# EAGLE design sha2017_rev0_0_1_dev (EAGLE 6.6.0)
Assembly variants: PRODUCTION

## Sheet 1 of 3
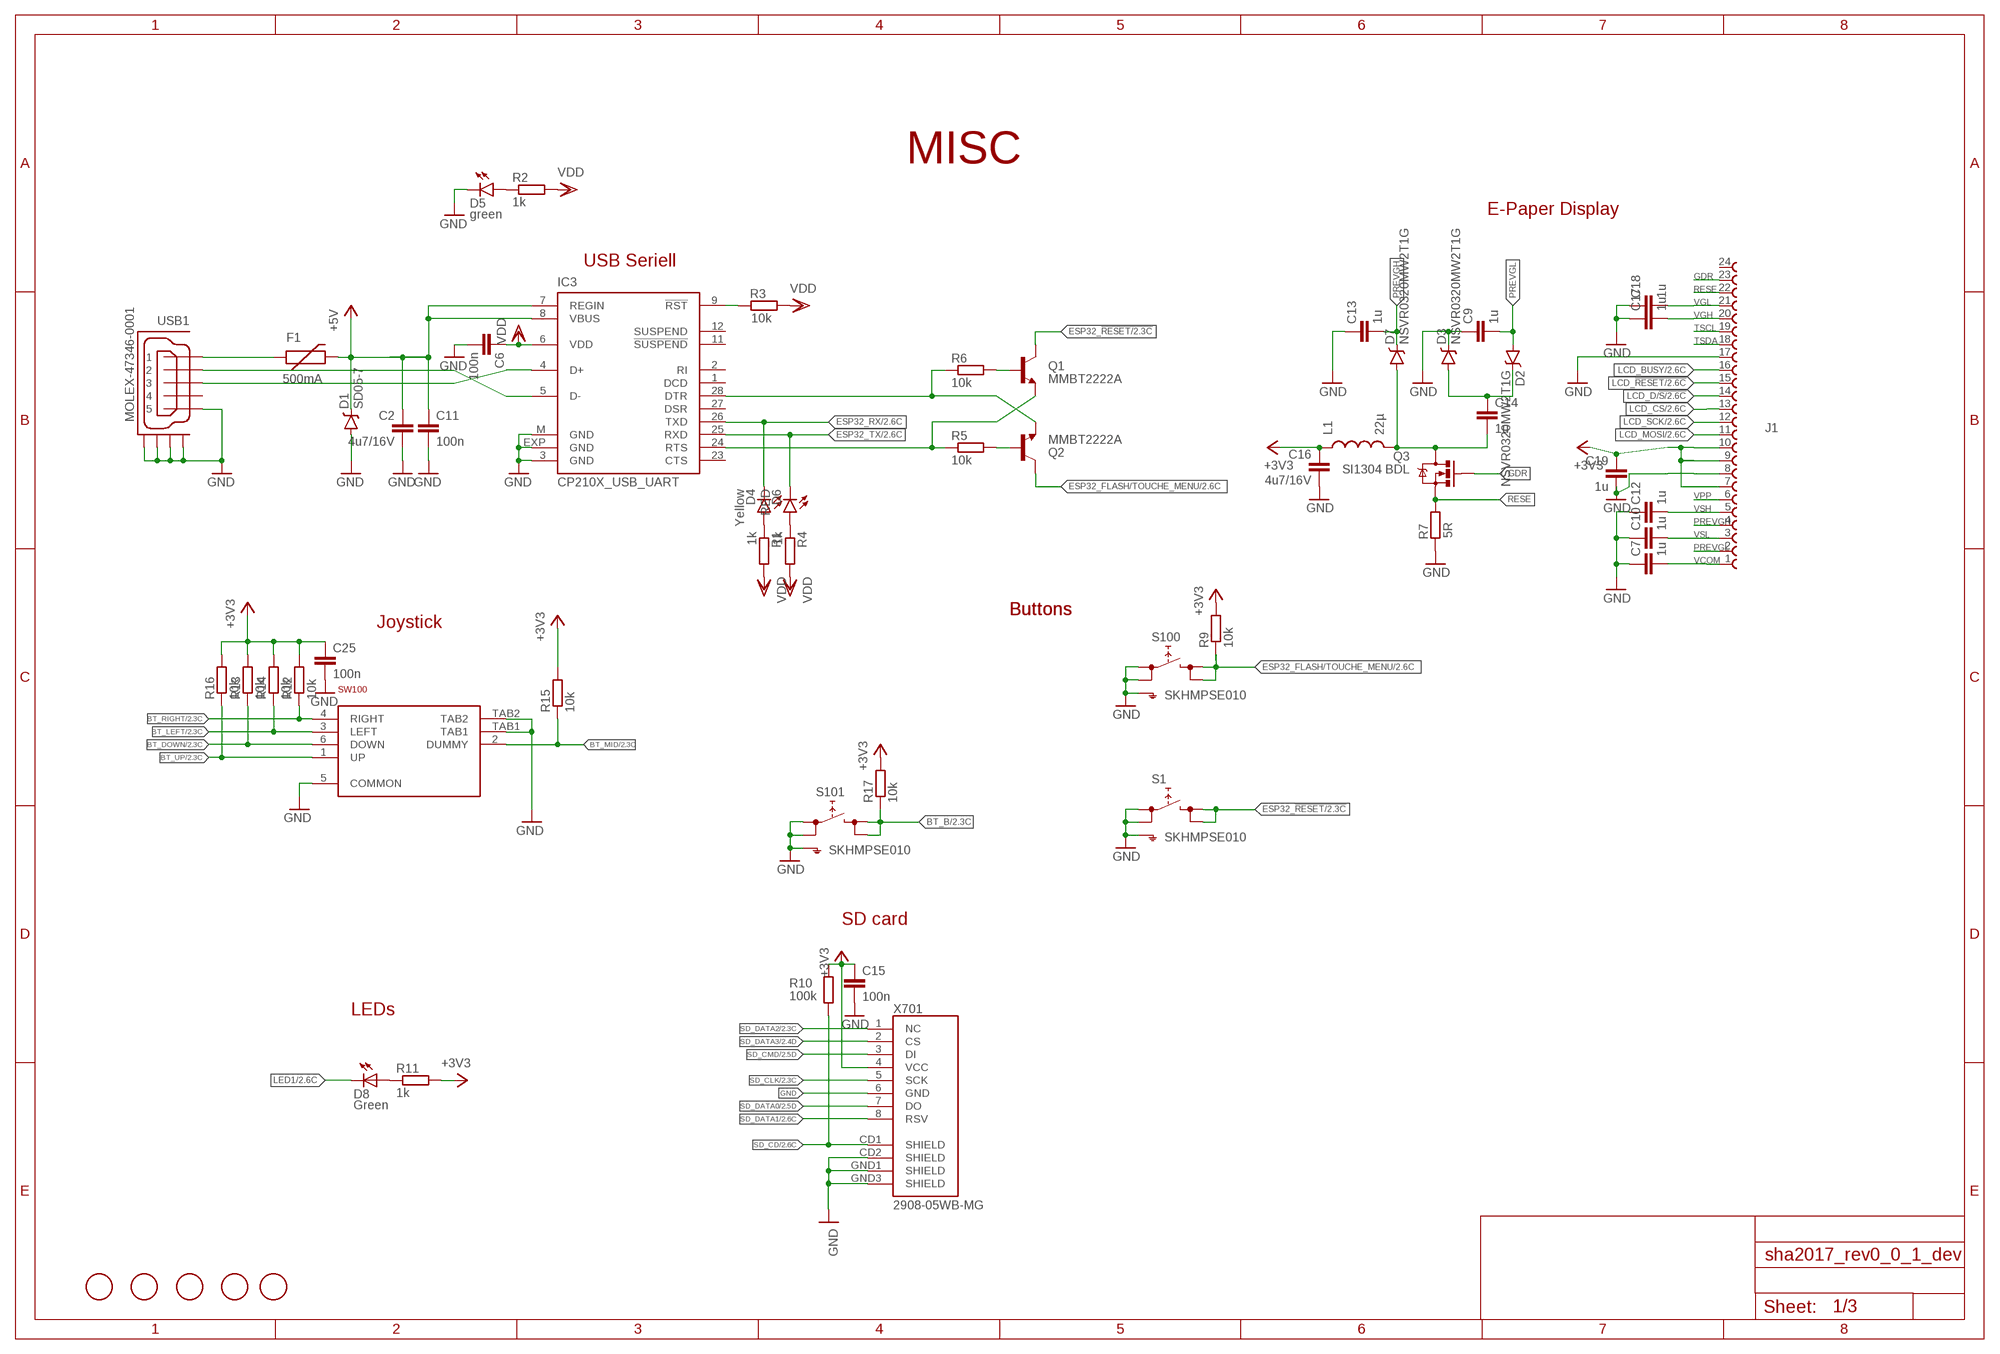
[diagram p0: schematic, sheet 1]

### Parts
C2  4u7/16V  C-EUC0805  [C0805]
C6  100n  C-EUC0603  [C0603]
C7  1u  C-EUC0603  [C0603]
C9  1u  C-EUC0603  [C0603]
C10  1u  C-EUC0603  [C0603]
C11  100n  C-EUC0603  [C0603]
C12  1u  C-EUC0603  [C0603]
C13  1u  C-EUC0603  [C0603]
C14  1u  C-EUC0603  [C0603]
C15  100n  C-EUC0603  [C0603]
C16  4u7/16V  C-EUC0805  [C0805]
C17  1u  C-EUC0603  [C0603]
C18  1u  C-EUC0603  [C0603]
C19  1u  C-EUC0603  [C0603]
C25  100n  C-EUC0603  [C0603]
D1  SD05-7  DIODE-SCHOTTKY-PMEG4005EJ  [SOD-323]
D2  NSVR0320MW2T1G  BAT20JFILM  [SOD-323]
D3  NSVR0320MW2T1G  BAT20JFILM  [SOD-323]
D4  Yellow  LED0603  [LED-0603]
D5  green  LED0603  [LED-0603]
D6  RED  LED0603  [LED-0603]
D7  NSVR0320MW2T1G  BAT20JFILM  [SOD-323]
D8  Green  LEDSML1206  [SML1206]
F1  500mA  PTCSMD  [PTC-1206]
FD1  FIDUCIAL  [FIDUCIAL_1MM]
FD2  FIDUCIAL  [FIDUCIAL_1MM]
FD3  FIDUCIAL  [FIDUCIAL_1MM]
FD4  FIDUCIAL  [FIDUCIAL_1MM]
FD5  FIDUCIAL  [FIDUCIAL_1MM]
IC3  CP210X_USB_UART  [MLP28]
J1  68712414022  [68712414022]
L1  22µ  INDUCTOR1210  [1210]
Q1  MMBT2222A  TRANSISTOR_NPNMMBT2222A  [SOT23-3]
Q2  MMBT2222A  TRANSISTOR_NPNMMBT2222A  [SOT23-3]
Q3  SI1304 BDL  MOSFET-NCHANNEL2N7002PW  [SOT323]
R1  1k  R-EU_R0603  [R0603]
R2  1k  R-EU_R0603  [R0603]
R3  10k  R-EU_R0603  [R0603]
R4  1k  R-EU_R0603  [R0603]
R5  10k  R-EU_R0603  [R0603]
R6  10k  R-EU_R0603  [R0603]
R7  5R  R0603-DASHES  [R0603-DASHES]
R9  10k  R-EU_R0603  [R0603]
R10  100k  R-EU_R0603  [R0603]
R11  1k  R-EU_R0603  [R0603]
R12  10k  R-EU_R0603  [R0603]
R13  10k  R-EU_R0603  [R0603]
R14  10k  R-EU_R0603  [R0603]
R15  10k  R-EU_R0603  [R0603]
R16  10k  R-EU_R0603  [R0603]
R17  10k  R-EU_R0603  [R0603]
S1  SKHMPSE010  [SKHMPXE010]
S100  SKHMPSE010  [SKHMPXE010]
S101  SKHMPSE010  [SKHMPXE010]
SW100  MCMT5-F-V  [MCMT5-F-V]
USB1  MOLEX-47346-0001  [MOLEX-47364-0001]
X701  2908-05WB-MG  [MICRO-SD-SOCKET-PP]  (not fitted in variant PRODUCTION)

### Nets
+3V3: C15.1 C16.1 C19.1 C25.1 J1.7 J1.9 J1.10 L1.1 R9.2 R10.1 R11.2 R12.2 R13.2 R14.2 R15.2 R16.2 R17.2 X701.4(VCC) ; also sheet 2,3
+5V [GND/3V3]: C2.1 C11.1 D1.C F1.2 IC3.7(REGIN) IC3.8(VBUS) ; also sheet 3
BT_B: R17.1 S101.3(2.1) S101.4(2.2) ; also sheet 2
BT_DOWN: R13.1 SW100.6(DOWN) ; also sheet 2
BT_LEFT: R14.1 SW100.3(LEFT) ; also sheet 2
BT_MID: R15.1 SW100.2(DUMMY) ; also sheet 2
BT_RIGHT: R12.1 SW100.4(RIGHT) ; also sheet 2
BT_UP: R16.1 SW100.1(UP) ; also sheet 2
ESP32_!RESET: Q1.3(C) S1.3(2.1) S1.4(2.2) ; also sheet 2
ESP32_FLASH/TOUCHE_MENU: Q2.3(C) R9.1 S100.3(2.1) S100.4(2.2) ; also sheet 2
ESP32_RX: D4.C IC3.26(TXD) ; also sheet 2
ESP32_TX: D6.C IC3.25(RXD) ; also sheet 2
GDR: J1.23 Q3.1(G)
GND: C2.2 C6.2 C7.1 C9.1 C10.1 C11.2 C12.1 C13.1 C15.2 C16.2 C17.1 C18.1 C19.2 C25.2 D1.A D3.C D5.C IC3.3(GND) IC3.EXP(GND) IC3.M(GND) J1.8 J1.17 R7.2 S1.1(1.1) S1.2(1.2) S1.5(SH) S100.1(1.1) S100.2(1.2) S100.5(SH) S101.1(1.1) S101.2(1.2) S101.5(SH) SW100.5(COMMON) SW100.TAB1 SW100.TAB2 USB1.5 USB1.GND1 USB1.GND2 USB1.GND3 USB1.GND4 X701.6(GND) X701.CD2(SHIELD) X701.GND1(SHIELD) X701.GND3(SHIELD) ; also sheet 2,3
LCD_!RESET: J1.15 ; also sheet 2
LCD_BUSY: J1.16 ; also sheet 2
LCD_CS: J1.13 ; also sheet 2
LCD_D/!S: J1.14 ; also sheet 2
LCD_MOSI: J1.11 ; also sheet 2
LCD_SCK: J1.12 ; also sheet 2
LED1: D8.C ; also sheet 2
N$8: IC3.9(!RST) R3.2
N$10: IC3.24(RTS) Q1.2(E) R5.1
N$11: IC3.28(DTR) Q2.2(E) R6.1
N$13: Q2.1(B) R5.2
N$14: Q1.1(B) R6.2
N$22: C14.1 D2.C D3.A
N$23: C14.2 D7.A L1.2 Q3.3(D)
N$25: D8.A R11.1
N$26: D5.A R2.1
N$27: D4.A R1.1
N$28: D6.A R4.1
N$32 [GND/3V3]: F1.1 USB1.1
PREVGH: C13.2 D7.C J1.4
PREVGL: C9.2 D2.A J1.2
RESE: J1.22 Q3.2(S) R7.1
SD_CD: R10.2 X701.CD1(SHIELD) ; also sheet 2
SD_CLK: X701.5(SCK) ; also sheet 2
SD_CMD: X701.3(DI) ; also sheet 2
SD_DATA0: X701.7(DO) ; also sheet 2
SD_DATA1: X701.8(RSV) ; also sheet 2
SD_DATA2: X701.1(NC) ; also sheet 2
SD_DATA3: X701.2(CS) ; also sheet 2
TSCL: J1.19
TSDA: J1.18
USB_DN_CON: IC3.5(D-) USB1.2
USB_DP_CON: IC3.4(D+) USB1.3
VCOM: C7.2 J1.1
VDD: C6.1 IC3.6(VDD) R1.2 R2.2 R3.1 R4.2
VGH: C17.2 J1.20
VGL: C18.2 J1.21
VPP: J1.6
VSH: C12.2 J1.5
VSL: C10.2 J1.3
Unconnected: IC3.1(DCD) IC3.2(RI) IC3.11(!SUSPEND) IC3.12(SUSPEND) IC3.23(CTS) IC3.27(DSR) J1.24 USB1.4

### Notes on the sheet
- MISC
- E-Paper Display
- USB Seriell
- Buttons | Buttons
- Joystick
- SD card
- LEDs

## Sheet 2 of 3
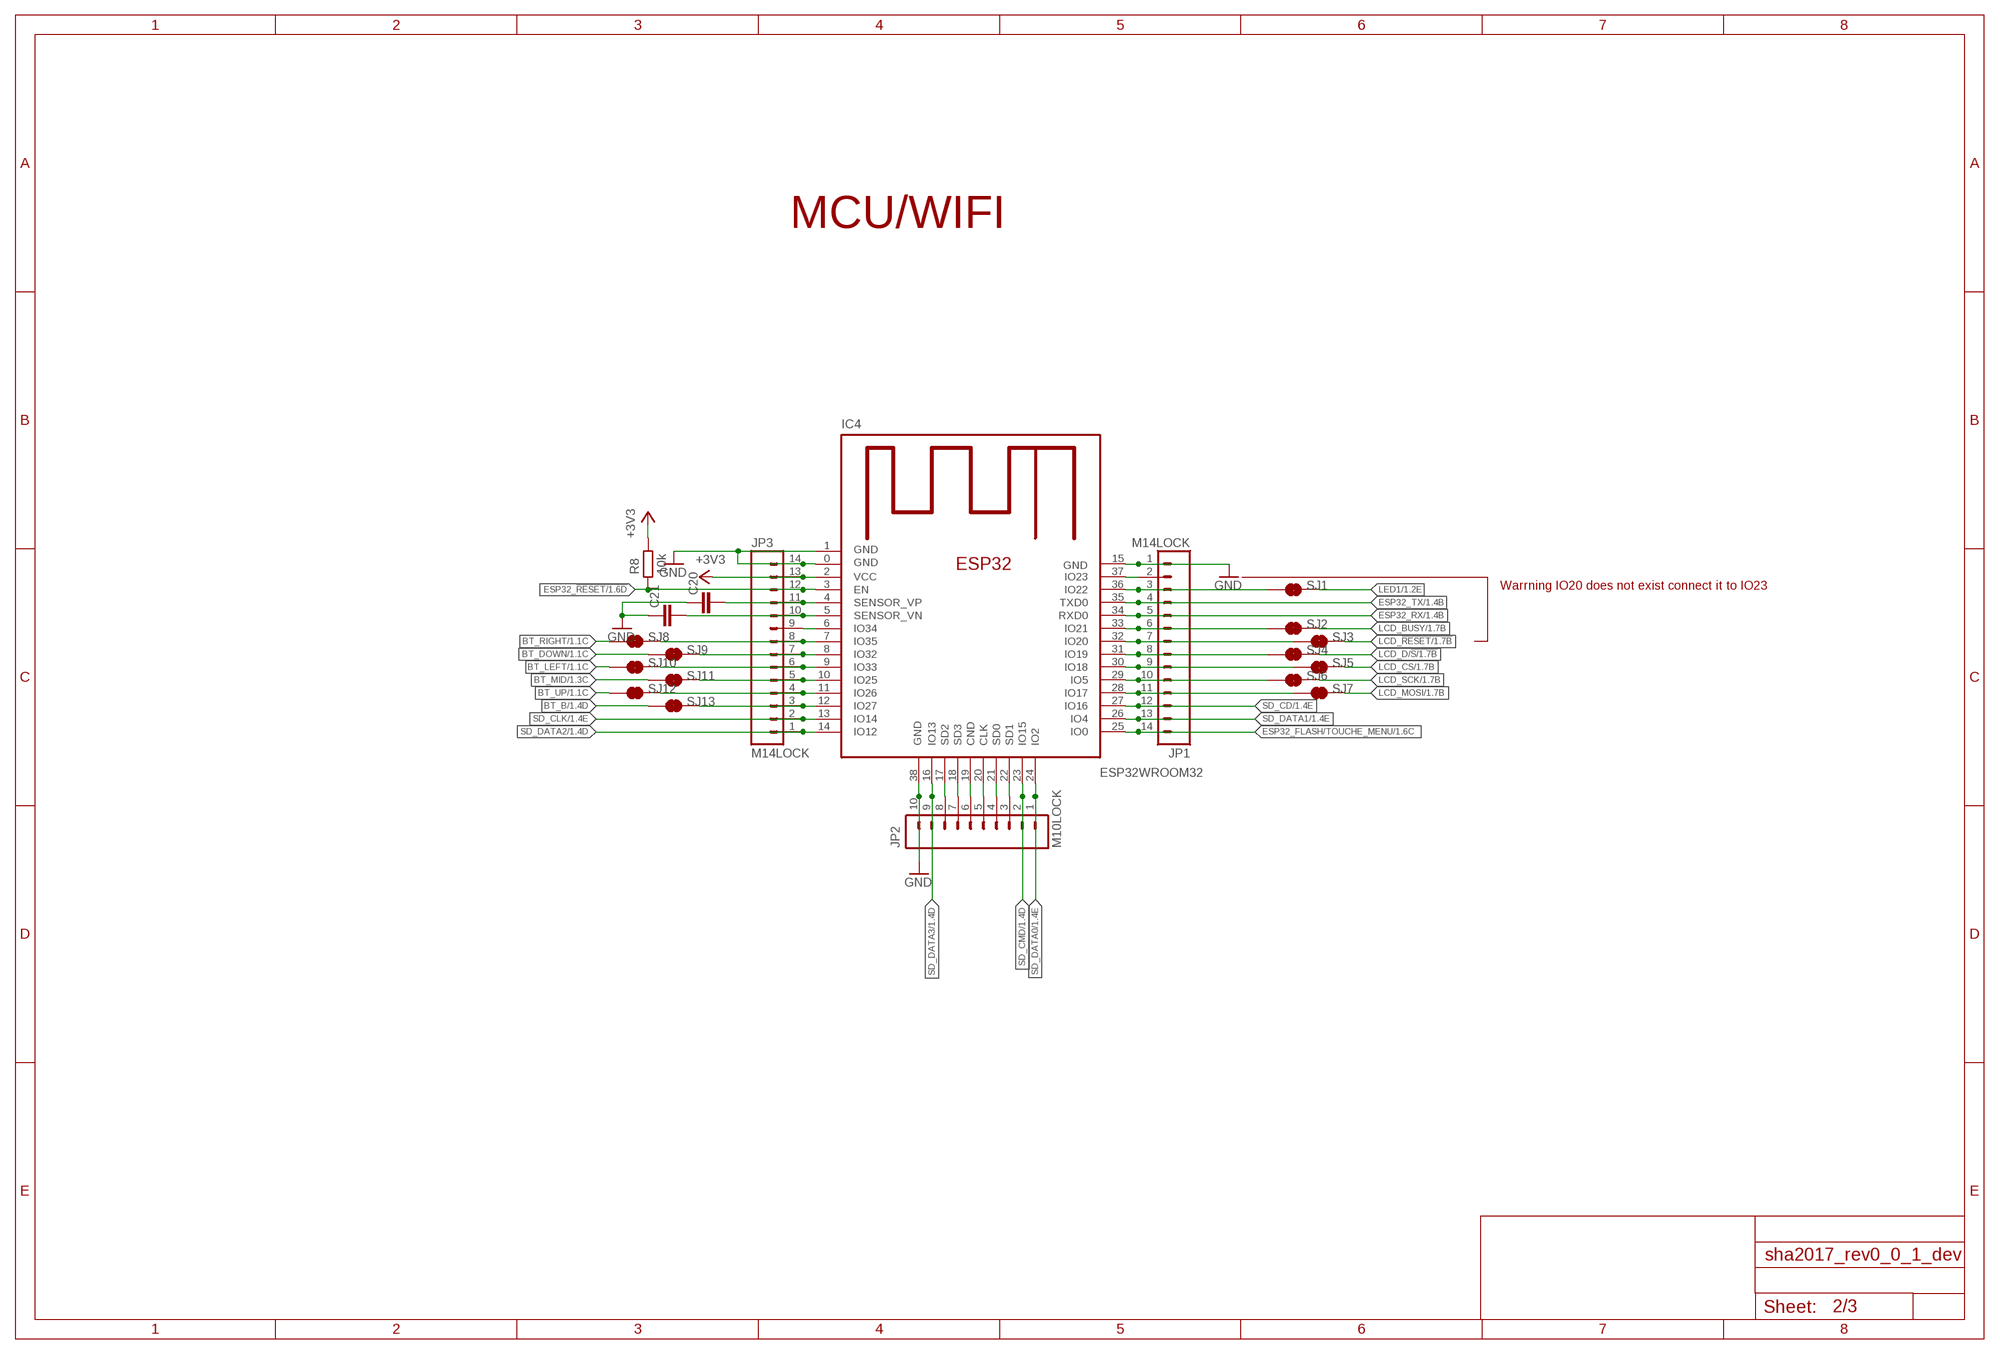
[diagram p1: schematic, sheet 2]

### Parts
C20  C-EUC0603  [C0603]
C21  C-EUC0603  [C0603]
IC4  ESP32WROOM32  [ESP32MOD]
JP1  M14LOCK  [1X14_LOCK]
JP2  M10LOCK  [1X10_LOCK]
JP3  M14LOCK  [1X14_LOCK]
R8  10k  R-EU_R0603  [R0603]
SJ1  JUMPER-PAD-2-NC_BY_TRACE  [PAD-JUMPER-2-NC_BY_TRACE_YES_SILK]
SJ2  JUMPER-PAD-2-NC_BY_TRACE  [PAD-JUMPER-2-NC_BY_TRACE_YES_SILK]
SJ3  JUMPER-PAD-2-NC_BY_TRACE  [PAD-JUMPER-2-NC_BY_TRACE_YES_SILK]
SJ4  JUMPER-PAD-2-NC_BY_TRACE  [PAD-JUMPER-2-NC_BY_TRACE_YES_SILK]
SJ5  JUMPER-PAD-2-NC_BY_TRACE  [PAD-JUMPER-2-NC_BY_TRACE_YES_SILK]
SJ6  JUMPER-PAD-2-NC_BY_TRACE  [PAD-JUMPER-2-NC_BY_TRACE_YES_SILK]
SJ7  JUMPER-PAD-2-NC_BY_TRACE  [PAD-JUMPER-2-NC_BY_TRACE_YES_SILK]
SJ8  JUMPER-PAD-2-NC_BY_TRACE  [PAD-JUMPER-2-NC_BY_TRACE_YES_SILK]
SJ9  JUMPER-PAD-2-NC_BY_TRACE  [PAD-JUMPER-2-NC_BY_TRACE_YES_SILK]
SJ10  JUMPER-PAD-2-NC_BY_TRACE  [PAD-JUMPER-2-NC_BY_TRACE_YES_SILK]
SJ11  JUMPER-PAD-2-NC_BY_TRACE  [PAD-JUMPER-2-NC_BY_TRACE_YES_SILK]
SJ12  JUMPER-PAD-2-NC_BY_TRACE  [PAD-JUMPER-2-NC_BY_TRACE_YES_SILK]
SJ13  JUMPER-PAD-2-NC_BY_TRACE  [PAD-JUMPER-2-NC_BY_TRACE_YES_SILK]

### Nets
+3V3: IC4.2(VCC) JP3.13 R8.1 ; also sheet 1,3
BT_B: SJ13.1 ; also sheet 1
BT_DOWN: SJ9.1 ; also sheet 1
BT_LEFT: SJ10.1 ; also sheet 1
BT_MID: SJ11.1 ; also sheet 1
BT_RIGHT: SJ8.1 ; also sheet 1
BT_UP: SJ12.1 ; also sheet 1
ESP32_!RESET: IC4.3(EN) JP3.12 R8.2 ; also sheet 1
ESP32_FLASH/TOUCHE_MENU: IC4.25(IO0) JP1.14 ; also sheet 1
ESP32_RX: IC4.34(RXD0) JP1.5 ; also sheet 1
ESP32_TX: IC4.35(TXD0) JP1.4 ; also sheet 1
GND: C20.1 C21.1 IC4.0(GND) IC4.1(GND) IC4.15(GND) IC4.38(GND) JP1.1 JP2.10 JP3.14 ; also sheet 1,3
LCD_!RESET: SJ3.2 ; also sheet 1
LCD_BUSY: SJ2.2 ; also sheet 1
LCD_CS: SJ5.2 ; also sheet 1
LCD_D/!S: SJ4.2 ; also sheet 1
LCD_MOSI: SJ7.2 ; also sheet 1
LCD_SCK: SJ6.2 ; also sheet 1
LED1: SJ1.2 ; also sheet 1
N$1: IC4.6(IO34) JP3.9
N$3: IC4.17(SD2) JP2.8
N$4: IC4.18(SD3) JP2.7
N$6: IC4.19(CND) JP2.6
N$7: IC4.20(CLK) JP2.5
N$9: IC4.21(SD0) JP2.4
N$12: IC4.22(SD1) JP2.3
N$15: IC4.37(IO23) JP1.2
N$16: IC4.36(IO22) JP1.3 SJ1.1
N$17: IC4.33(IO21) JP1.6 SJ2.1
N$18: IC4.32(IO20) JP1.7 SJ3.1
N$20: IC4.30(IO18) JP1.9 SJ5.1
N$21: IC4.29(IO5) JP1.10 SJ6.1
N$24: IC4.28(IO17) JP1.11 SJ7.1
N$42: C20.2 IC4.4(SENSOR_VP) JP3.11
N$43: C21.2 IC4.5(SENSOR_VN) JP3.10
N$44: IC4.7(IO35) JP3.8 SJ8.2
N$45: IC4.8(IO32) JP3.7 SJ9.2
N$46: IC4.9(IO33) JP3.6 SJ10.2
N$47: IC4.10(IO25) JP3.5 SJ11.2
N$48: IC4.11(IO26) JP3.4 SJ12.2
N$49: IC4.12(IO27) JP3.3 SJ13.2
N$63: IC4.31(IO19) JP1.8 SJ4.1
SD_CD: IC4.27(IO16) JP1.12 ; also sheet 1
SD_CLK: IC4.13(IO14) JP3.2 ; also sheet 1
SD_CMD: IC4.23(IO15) JP2.2 ; also sheet 1
SD_DATA0: IC4.24(IO2) JP2.1 ; also sheet 1
SD_DATA1: IC4.26(IO4) JP1.13 ; also sheet 1
SD_DATA2: IC4.14(IO12) JP3.1 ; also sheet 1
SD_DATA3: IC4.16(IO13) JP2.9 ; also sheet 1

### Notes on the sheet
- MCU/WIFI
- Warrning IO20 does not exist connect it to IO23

## Sheet 3 of 3
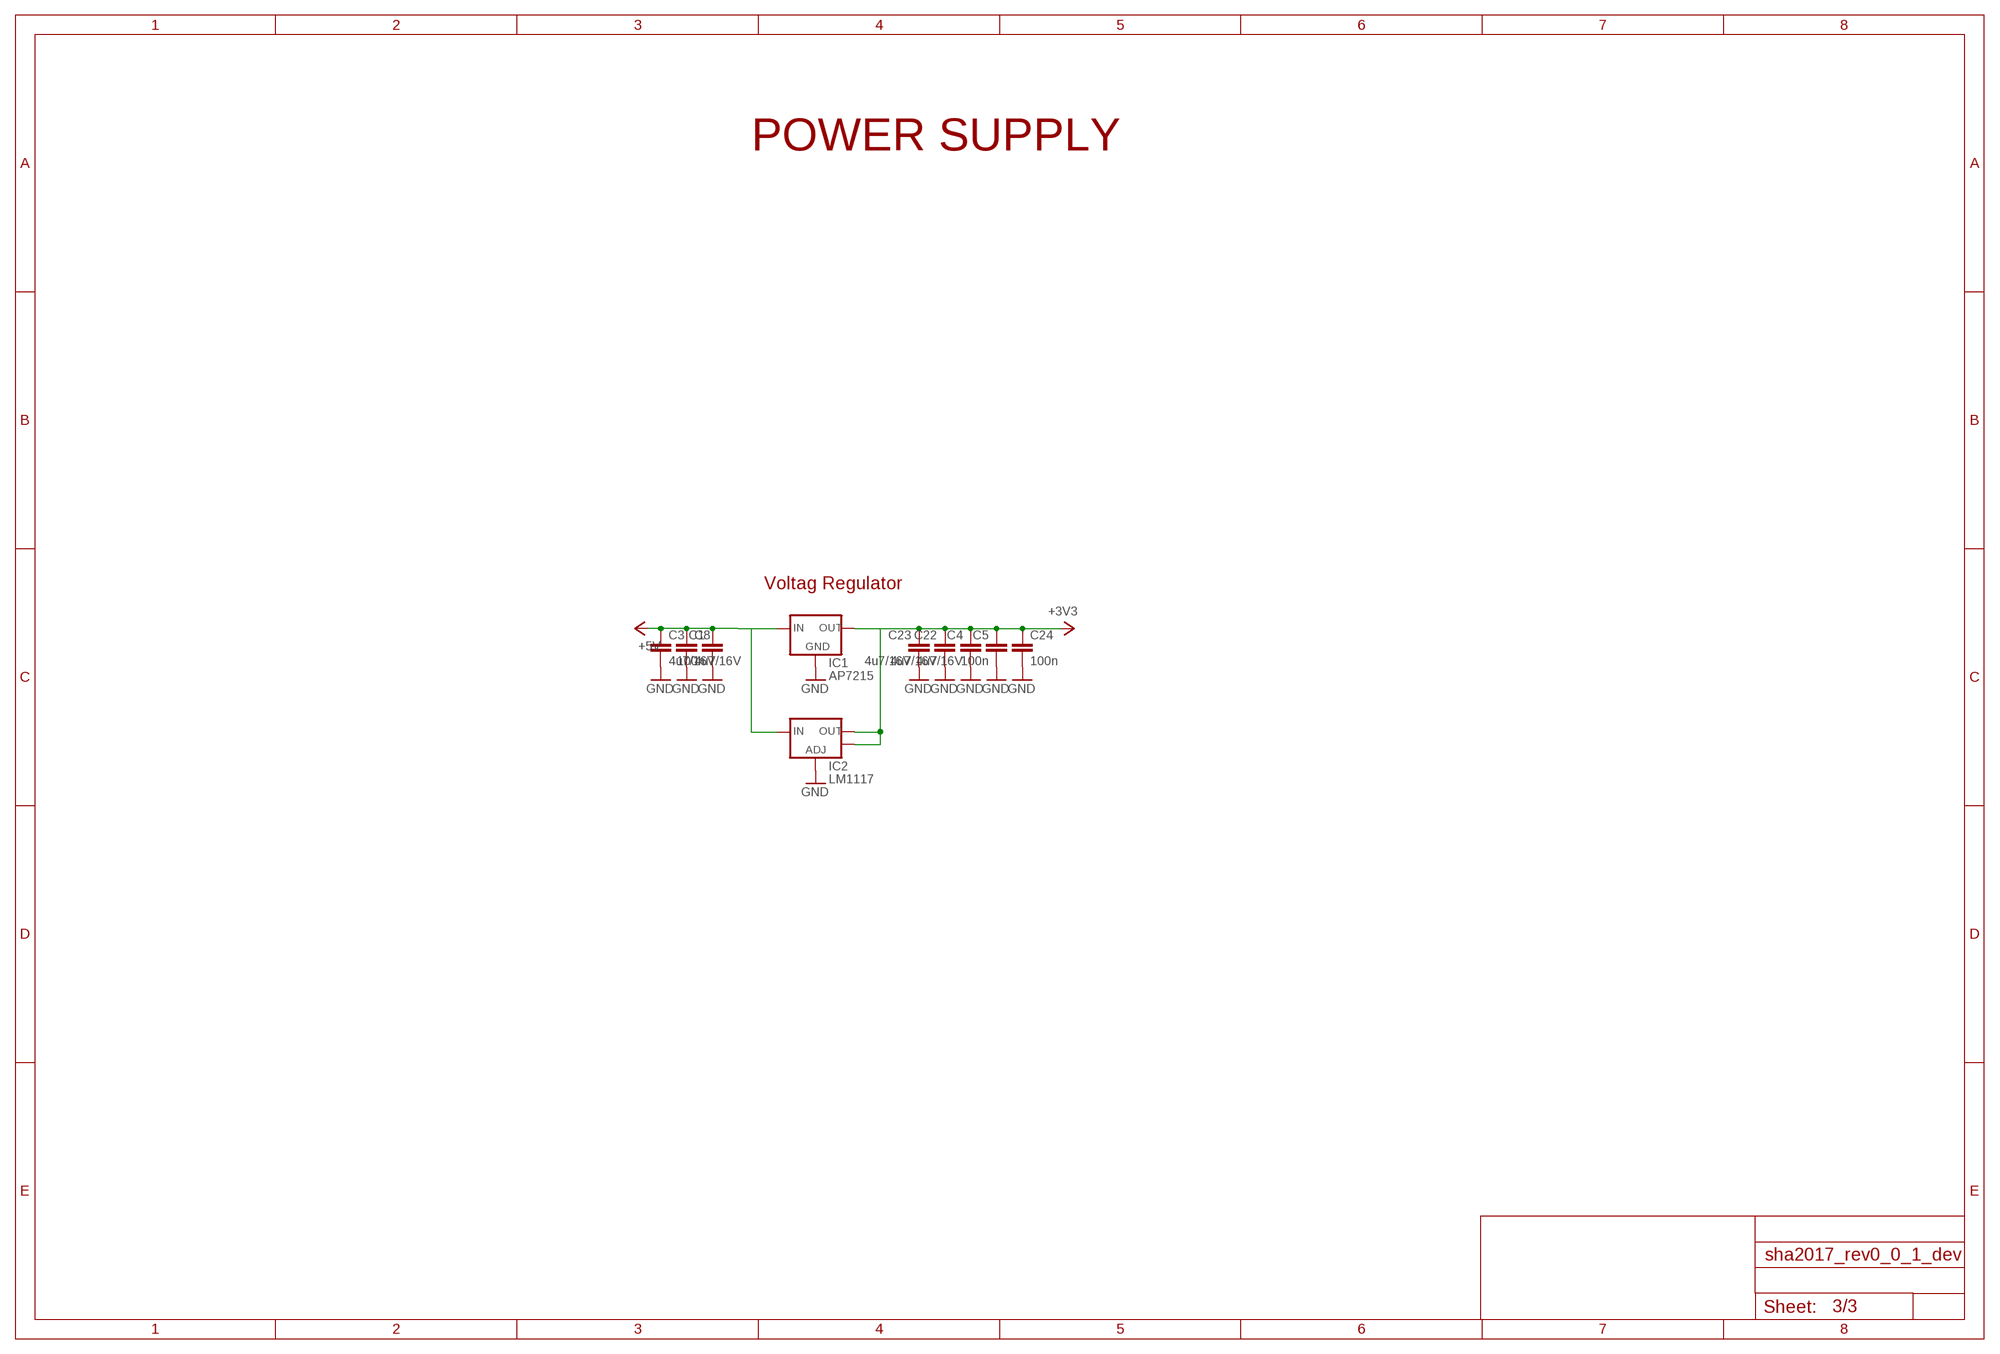
[diagram p2: schematic, sheet 3]

### Parts
C1  100n  C-EUC0603  [C0603]
C3  4u7/16V  C-EUC0805  [C0805]
C4  4u7/16V  C-EUC0805  [C0805]
C5  100n  C-EUC0603  [C0603]
C8  4u7/16V  C-EUC0805  [C0805]
C22  4u7/16V  C-EUC0805  [C0805]
C23  4u7/16V  C-EUC0805  [C0805]
C24  100n  C-EUC0603  [C0603]
IC1  AP7215  [SOT89]
IC2  LM1117  V_REG_LM1117SOT223  [SOT223]

### Nets
+3V3: C4.1 C5.1 C22.1 C23.1 C24.1 IC1.3(OUT) IC2.2(OUT) IC2.4(OUT) ; also sheet 1,2
+5V [GND/3V3]: C1.1 C3.1 C8.1 IC1.2(IN) IC1.2@(IN) IC2.3(IN) ; also sheet 1
GND: C1.2 C3.2 C4.2 C5.2 C8.2 C22.2 C23.2 C24.2 IC1.1(GND) IC2.1(ADJ) ; also sheet 1,2

### Notes on the sheet
- POWER SUPPLY
- Voltag Regulator

## Library data of the parts
C1 C5 C6 C11 C15 C24 C25 = rcl:C-EU: CAPACITOR, European symbol; PARTNO: GRM188R71H104KA93D
C2-C4 C8 C16 C22 C23 = rcl:C-EU: CAPACITOR, European symbol; PARTNO: GRM21BR61C475KA88K
C7 C9 C10 C12-C14 C17-C19 = rcl:C-EU: CAPACITOR, European symbol; PARTNO: GRM188R61E105KA12D
C20 C21 = rcl:C-EU: CAPACITOR, European symbol; OC_FARNELL: unknown
D1 = SparkFun-DiscreteSemi:DIODE-SCHOTTKY: Schottky diodes in SFE's production catalog BAT20J 1A 23V 0.62Vf RB751 120mA 40V 0.37Vf PMEG4005EJ 0.5A 40V 0.42Vf MBRA140 1A 40V 0.5Vf B340A 3A 40V SMA; PARTNO: PMEG4005EJ,115; PROD_ID: DIO-10955; VALUE: PMEG4005EJ
D2 D3 D7 = SparkFun-DiscreteSemi:BAT20JFILM: 23V, 1A Schottky diode, SOD-323 package; PARTNO: BAT20JFILM; PROD_ID: DIO-11623; VALUE: BAT20JFILM
D4-D6 = SparkFun-LED:LED: LEDs Standard schematic elements and footprints for 5mm, 3mm, 1206, and 0603 sized LEDs. 5mm - Spark Fun Electronics SKU : COM-00529 (and others)
D8 = led:LED: LED OSRAM: - CHIPLED LG R971, LG N971, LY N971, LG Q971, LY Q971, LO R971, LY R971 LH N974, LH R974 LS Q976, LO Q976, LY Q976 LO Q996 - Hyper CHIPLED LW Q18S LB Q993, LB Q99A, LB R99A - SideLED LS A670, LO A670, LY A670, LG A670, LP A670 LB A673, LV A673, LT A673, LW A673 LH A674 LY A675 LS A676, LA A676, LO A676, LY A676, LW A676 LS A679, LY A679, LG A679 - Hyper Micro SIDELED® LS Y876, LA Y876, LO Y876, LY Y876 LT Y87S - SmartLED LW L88C, LW L88S LB L89C, LB L89S, LG L890 LS L89K, LO L89K, LY L89K LS L896, LA L896, LO L896, LY L896 - TOPLED LS T670, LO T670, LY T670, LG T670, LP T670 LSG T670, LSP T670, LSY T670, LOP T670, LYG T670 LG T671, LOG T671, LSG T671 LB T673, LV T673, LT T673, LW T673 LH T674 LS T676, LA T676, LO T676, LY T676, LB T676, LH T676, LSB T676, LW T676 LB T67C, LV T67C, LT T67C, LS T67K, LO T67K, LY T67K, LW E67C LS E67B, LA E67B, LO E67B, LY E67B, LB E67C, LV E67C, LT E67C LW T67C LS T679, LY T679, LG T679 LS T770, LO T770, LY T770, LG T770, LP T770 LB T773, LV T773, LT T773, LW T773 LH T774 LS E675, LA E675, LY E675, LS T675 LS T776, LA T776, LO T776, LY T776, LB T776 LHGB T686 LT T68C, LB T68C - Hyper Mini TOPLED® LB M676 - Mini TOPLED Santana® LG M470 LS M47K, LO M47K, LY M47K Source: http://www.osram.convergy.de LUXEON: - LUMILED® LXK2-PW12-R00, LXK2-PW12-S00, LXK2-PW14-U00, LXK2-PW14-V00 LXK2-PM12-R00, LXK2-PM12-S00, LXK2-PM14-U00 LXK2-PE12-Q00, LXK2-PE12-R00, LXK2-PE12-S00, LXK2-PE14-T00, LXK2-PE14-U00 LXK2-PB12-K00, LXK2-PB12-L00, LXK2-PB12-M00, LXK2-PB14-N00, LXK2-PB14-P00, LXK2-PB14-Q00 LXK2-PR12-L00, LXK2-PR12-M00, LXK2-PR14-Q00, LXK2-PR14-R00 LXK2-PD12-Q00, LXK2-PD12-R00, LXK2-PD12-S00 LXK2-PH12-R00, LXK2-PH12-S00 LXK2-PL12-P00, LXK2-PL12-Q00, LXK2-PL12-R00 Source: www.luxeon.com KINGBRIGHT: KA-3528ASYC Source: www.kingbright.com; PARTNO: 156120VS75300
F1 = SparkFun-PowerIC:PTC: Resettable Fuse PTC Resettable Fuse. Spark Fun Electronics SKU : COM-08357; PARTNO: 0ZCJ0025FF2E; PROD_ID: RES-11150
FD1-FD5 = adafruit:FIDUCIAL: For use by pick and place machines to calibrate the vision/machine, 1mm By microbuilder.eu; OC_FARNELL: unknown
IC1 = badge:AP7215; PARTNO: AP7215-33YG-13
IC2 = SparkFun-PowerIC:V_REG_LM1117: Voltage Regulator LM1117 Standard adjustable voltage regulator but in SMD form. Spark Fun Electronics SKU : COM-00595; PARTNO: LM1117MPX-3.3/NOPB; PROD_ID: VREG-08170
IC3 = SparkFun-DigitalIC:CP210X_USB_UART: Single-Chip USB to UART Bridge Source: www.silabs.com .. CP2101.pdf / cp2102.pdf. Spark Fun Electronics SKU : COM-00310; PARTNO: CP2102-GMR
IC4 = ESP3x:ESP32WROOM32
J1 = EAGLE-FPC_CONNECTOR_AND_FFC_CAB-rev1:68712414022: WR-FPC 0.5mm SMT ZIF Horizontal Top Contact, 24 Pins=>Code : Con_FPC_ZIF_0.50_68712414022 <http://katalog.we-online.de/media/images/eican/Con_FPC_ZIF_0.50_6871xx14022_pf2.jpg> Details see: http://katalog.we-online.de/en/em/687_1xx_140_22 Created 2014-07-09, Karrer Zheng 2014 (C) Würth Elektronik; PARTNO: 68712414022
JP1 JP3 = SparkFun-Connectors:M14: Header 14 Standard 14-pin 0.1" header. Use with straight break away headers (SKU : PRT-00116), right angle break away headers (PRT-00553), swiss pins (PRT-00743), machine pins (PRT-00117), and female headers (PRT-00115).
JP2 = SparkFun-Connectors:M10: Header 10 Standard 10-pin 0.1" header. Use with straight break away headers (SKU : PRT-00116), right angle break away headers (PRT-00553), swiss pins (PRT-00743), machine pins (PRT-00117), and female headers (PRT-00115).
L1 = SparkFun-Passives:INDUCTOR: Inductors Basic Inductor/Choke - 0603 and 1206. Footprints are not proven and vary greatly between part numbers. SRN6045- 33uH, 20% 1.4A SDR0403-560KL - 56uH, 10%, 500mA RMS/740mA peak; PARTNO: NLCV32T-220K-EF
Q1 Q2 = SparkFun-DiscreteSemi:TRANSISTOR_NPN: Generic NPN BJT MMBT2222A - TRANS-08049 (SOT-23, 1A 40V) MPSA42 - TRANS-09116 (SOT-23, 500mA 300V) MMBT5088LT1G - TRANS-11160 (SOT-23, 50 mA 30V) BC547 - COM-08928 <http://www.sparkfun.com/products/8928> (TO-92 45V 100mA) (1.Collector 2.Base 3.Emitter) 2N3904 - COM-00521 <http://www.sparkfun.com/products/521> (TO-92 40V 200mA) (1.Emitter 2.Base 3.Collector) P2N2222A - COM-12852 <http://www.sparkfun.com/products/12852> (TO-92 40V 600mA) (1.Collector 2.Base 3.Emitter); PARTNO: BC817-25,215; PROD_ID: TRANS-08049
Q3 = SparkFun-DiscreteSemi:MOSFET-NCHANNEL: Common NMOSFET Parts MFG P/N Store ID Prod ID FDD8780 TRANS-09984 SI7820DN TRANS-11055 FDS6630A IC-08089 2N7002PW TRANS-11151 FQP30N06L COM-10213 TRANS-10060 BSS123LT1G TRANS-08345 BSS138 TRANS-00830 BS170 2N7000; PARTNO: SI1308EDL-T1-GE3; PROD_ID: TRANS-11151
R1 R2 R4 R11 = rcl:R-EU_: RESISTOR, European symbol; PARTNO: ERJ-3GEYJ102V
R3 R5 R6 R9 R12-R17 = rcl:R-EU_: RESISTOR, European symbol; PARTNO: ERJ-3GEYJ103V
R7 = 00ralf:R0603-DASHES; PARTNO: ERJ-3GEYJ5R1V
R8 = rcl:R-EU_: RESISTOR, European symbol; OC_FARNELL: unknown; PARTNO: ERJ-3GEYJ103V
R10 = rcl:R-EU_: RESISTOR, European symbol; PARTNO: CRCW0603100KFKEA
S1 S100 S101 = switch:SKHMP*E010: 6.2 X 6.5mm TACT Switch (SMD) Source: http://www3.alps.co.jp/WebObjects/catalog.woa/PDF/E/Switch/Tact/SKHM/SKHM.PDF; PARTNO: SKHMQME010
SJ1-SJ13 = SparkFun-Passives:JUMPER-PAD-2-NC_BY_TRACE
SW100 = badge:MCMT5-F-V; PARTNO: SKRHAAE010
USB1 = usb_con-update:MOLEX-47346-0001: MICRO USB B, BOTTOM MOUNT; PARTNO: 10118194-0001LF
X701 = con-3m:2908-: 3M Card Connector microSD Normal Polarisation, Push-Push, Surface-Mount, 2900 Series 2908-05WB-MG: Surface mount, right angle Supplier: DigiKey 3M5607CT-ND Source: http://solutions.3m.com/wps/portal/3M/en_US/FP/FireProtection/Products/ProductCatalog/?PC_7_RJH9U5230GE3E02LECFTDQ0R92_nid=GGFDLLB87CbeGKZPW31NMHgl; PARTNO: 2908-05WB-MG

## Net classes
1 FAT: width 0.2 mm, drill 0.4 mm
2 GND/3V3: width 0.2 mm, drill 0.4 mm

## Board
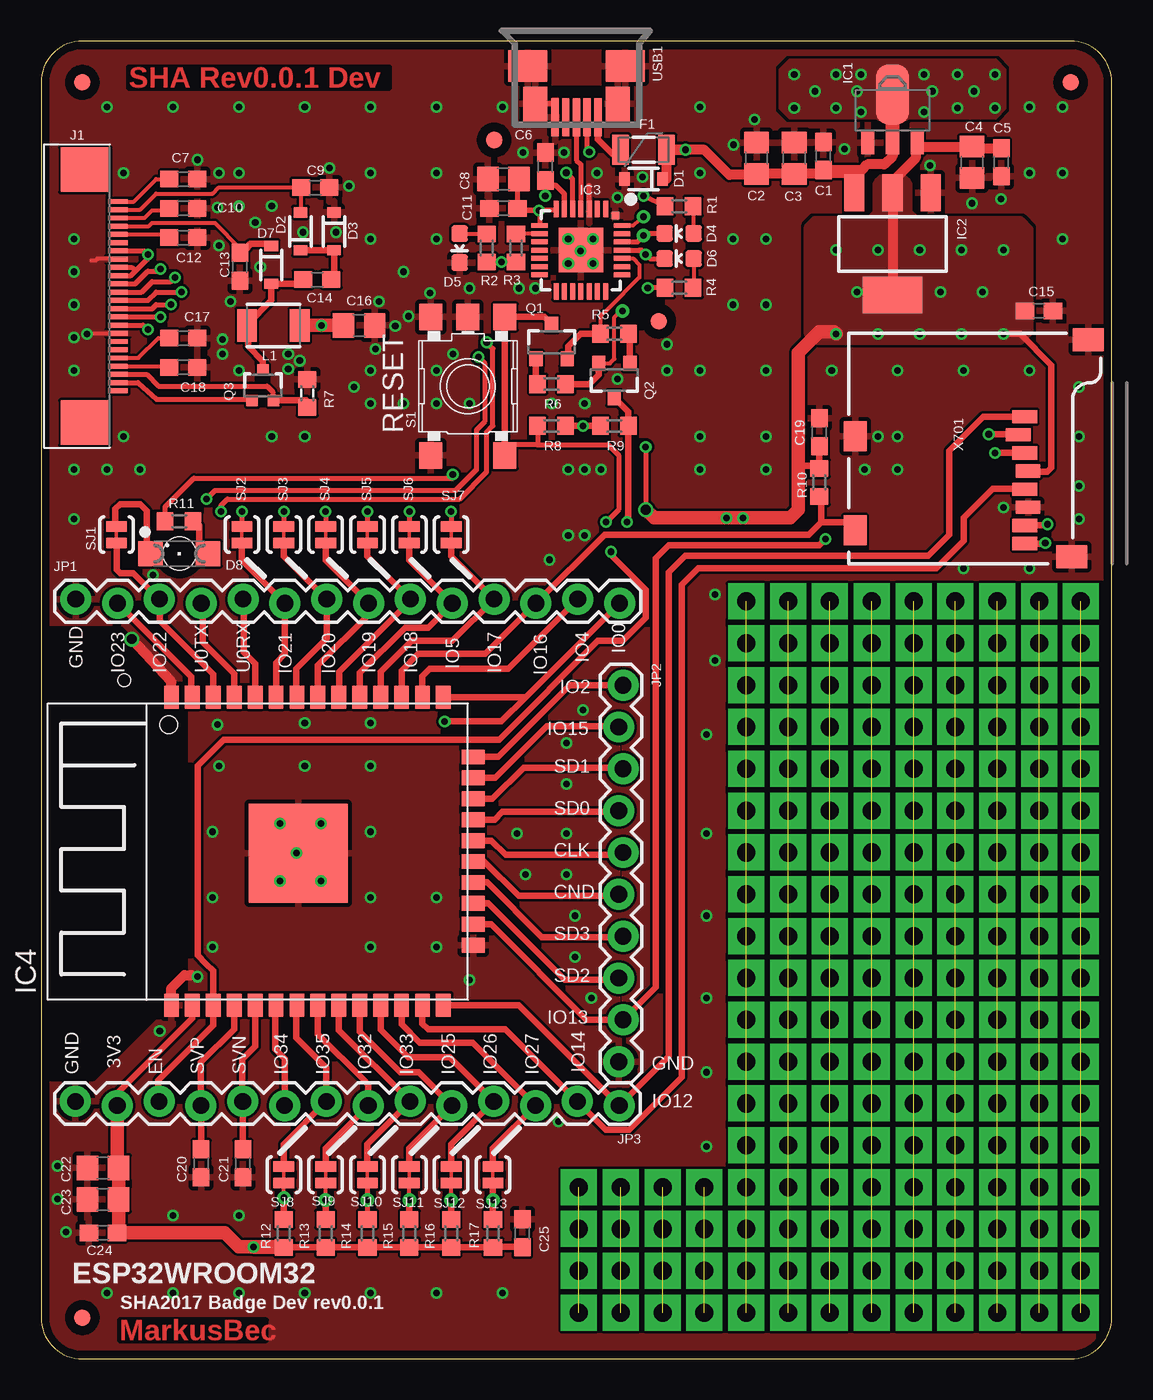
[diagram p3: board, top side]
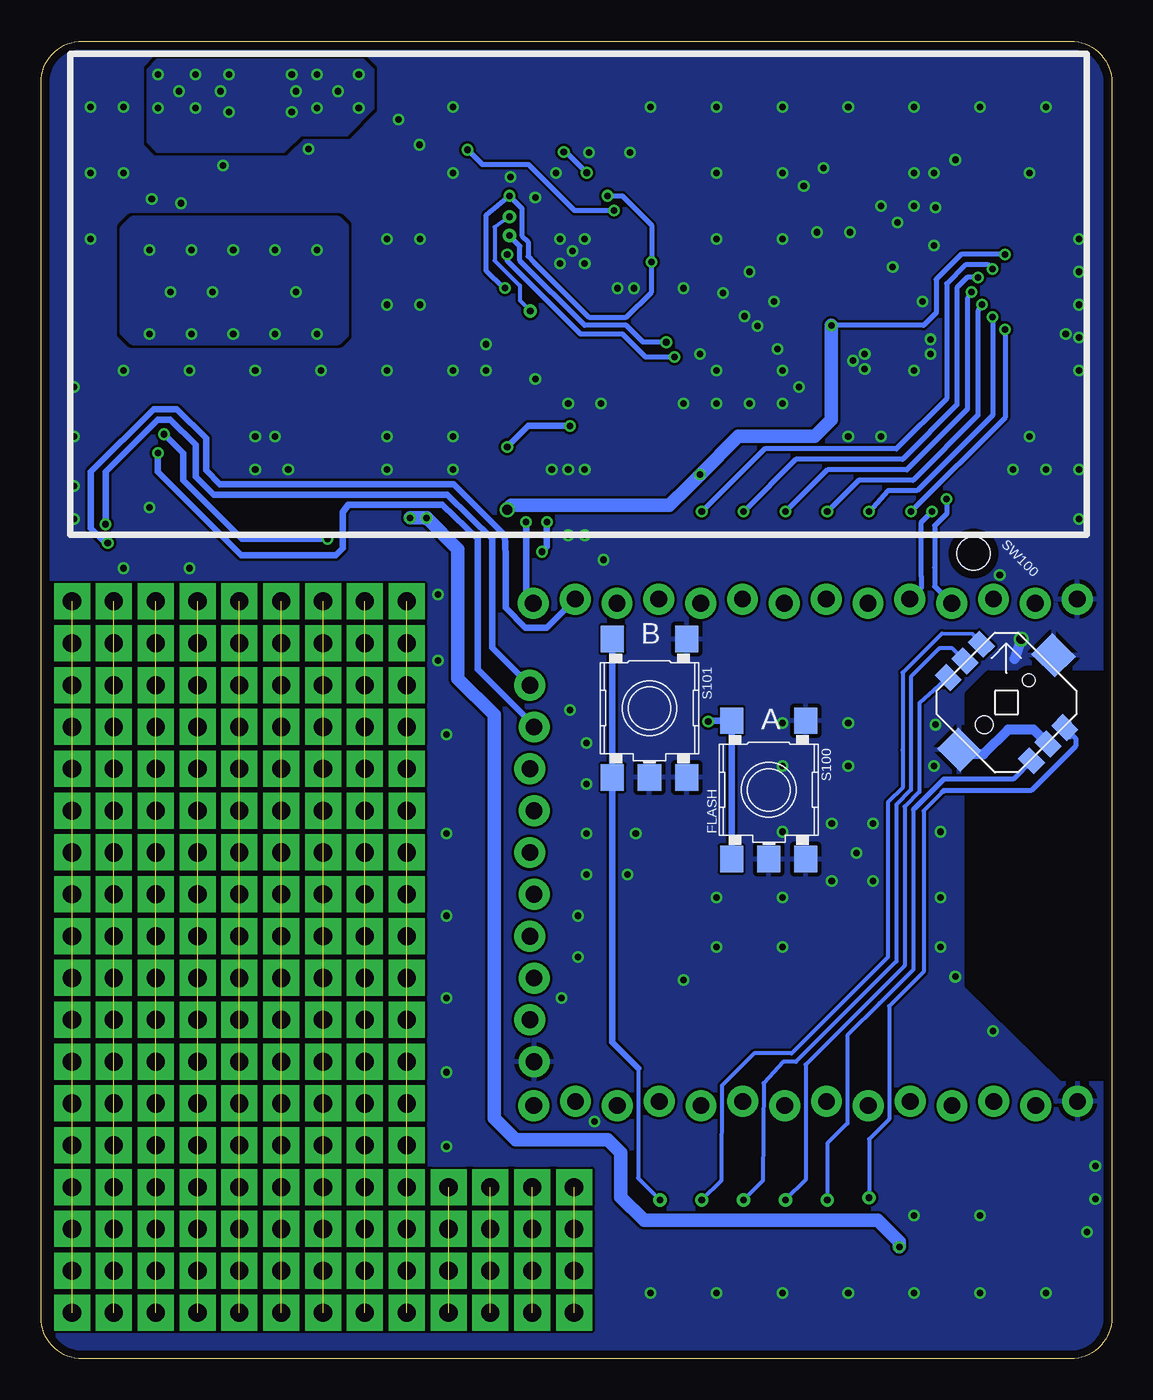
[diagram p4: board, bottom side, seen from below]

Size 65 x 80 mm. Coordinates in mm from the lower left corner, seen from the top.
Outline: 0,77.5 0,2.5 arc90 2.5,0 62.5,0 arc90 65,2.5 65,77.5 arc90 62.5,80 2.5,80 arc90 0,77.5
Copper layers (1*16): Top 0.035mm / dielectric 1.6mm / Bottom 0.035mm
Design rules "Elecrow_2-layer_PCB_eagle_rule": minimum track width 6mil, minimum drill 12mil, track to track 6mil, track to pad 6mil, pad to pad 6mil, via to via 8mil, smd to smd 0mil, copper to edge 20mil, drill to drill 10mil, minimum pad ring 6mil, minimum via ring 6mil, stop-mask expansion 0mil, vias tented up to drill 100mil, thermal gap 10mil
Holes 2 mm at 8.4,48.9
tRestrict: area 0.1,17 to 8.8,44.3
bRestrict: area 0.1,17 to 8.8,41.7

### Footprints (pad centres in the part's own frame; a part is rotated, then mirrored left to right if it is on the bottom)
C0603 = smd 1.1 x 1: 1 -0.85,0; 2 0.85,0
C0805 = smd 1.3 x 1.5: 1 -0.95,0; 2 0.95,0
SOD-323 = smd 0.63 x 0.83: A 1.15,0; C -1.15,0
LED-0603 = smd 1 x 1: A 0,-0.877; C 0,0.877
SML1206 = smd 1.5 x 1.5: A 1.75,0; C -1.75,0
PTC-1206 = smd 1 x 1.8: 1 -1.4,0; 2 1.4,0
FIDUCIAL_1MM = smd 1 x 1: 1 0,0
SOT89 = smd 0.8 x 1.4: 1 -1.499,-1.981; 3 1.499,-1.981 | smd 0.813 x 1.397: 2 0,-1.981 | smd 2.032 x 3.65: 2@ 0,0.94
SOT223 = smd 1.219 x 2.235: 1 -2.311,-3.099; 2 0,-3.099; 3 2.311,-3.099 | smd 3.6 x 2.2: 4 0,3.099
MLP28 = smd 1 x 0.3: 1 -2.5,1.5; 2 -2.5,1; 3 -2.5,0.5; 4 -2.5,0; 5 -2.5,-0.5; 6 -2.5,-1; 7 -2.5,-1.5; 15 2.5,-1.5; 16 2.5,-1; 17 2.5,-0.5; 18 2.5,0; 19 2.5,0.5; 20 2.5,1; 21 2.5,1.5 | smd 0.3 x 1: 8 -1.5,-2.5; 9 -1,-2.5; 10 -0.5,-2.5; 11 0,-2.5; 12 0.5,-2.5; 13 1,-2.5; 14 1.5,-2.5; 22 1.5,2.5; 23 1,2.5; 24 0.5,2.5; 25 0,2.5; 26 -0.5,2.5; 27 -1,2.5; 28 -1.5,2.5 | smd 2.7 x 2.7: EXP 0,0 | smd 0.435 x 0.435: M -2.103,2.103
ESP32MOD = smd 6 x 6: 0 9.9,12.3 | smd 1.4 x 0.9: 1 0.68,19.99; 2 0.68,18.72; 3 0.68,17.45; 4 0.68,16.18; 5 0.68,14.91; 6 0.68,13.64; 7 0.68,12.37; 8 0.68,11.1; 9 0.68,9.83; 10 0.68,8.56; 11 0.68,7.29; 12 0.68,6.02; 13 0.68,4.75; 14 0.68,3.48; 25 19.38,3.48; 26 19.38,4.75; 27 19.38,6.02; 28 19.38,7.29; 29 19.38,8.56; 30 19.38,9.83; 31 19.38,11.1; 32 19.38,12.37; 33 19.38,13.64; 34 19.38,14.91; 35 19.38,16.18; 36 19.38,17.45; 37 19.38,18.72; 38 19.38,19.99 | smd 0.9 x 1.4: 15 4.31,1.68; 16 5.58,1.68; 17 6.85,1.68; 18 8.12,1.68; 19 9.39,1.68; 20 10.66,1.68; 21 11.93,1.68; 22 13.2,1.68; 23 14.47,1.68; 24 15.74,1.68
68712414022 = smd 0.3 x 1.2: 1 -5.75,0.6; 2 -5.25,0.6; 3 -4.75,0.6; 4 -4.25,0.6; 5 -3.75,0.6; 6 -3.25,0.6; 7 -2.75,0.6; 8 -2.25,0.6; 9 -1.75,0.6; 10 -1.25,0.6; 11 -0.75,0.6; 12 -0.25,0.6; 13 0.25,0.6; 14 0.75,0.6; 15 1.25,0.6; 16 1.75,0.6; 17 2.25,0.6; 18 2.75,0.6; 19 3.25,0.6; 20 3.75,0.6; 21 4.25,0.6; 22 4.75,0.6; 23 5.25,0.6; 24 5.75,0.6 | smd 2.7 x 3: 25 -7.68,-1.38; 26 7.68,-1.38
1X14_LOCK = drill 1.016 pad 1.88: 1 0,0.127; 2 2.54,-0.127; 3 5.08,0.127; 4 7.62,-0.127; 5 10.16,0.127; 6 12.7,-0.127; 7 15.24,0.127; 8 17.78,-0.127; 9 20.32,0.127; 10 22.86,-0.127; 11 25.4,0.127; 12 27.94,-0.127; 13 30.48,0.127; 14 33.02,-0.127
1X10_LOCK = drill 1.016 pad 1.88: 1 0,0.127; 2 2.54,-0.127; 3 5.08,0.127; 4 7.62,-0.127; 5 10.16,0.127; 6 12.7,-0.127; 7 15.24,0.127; 8 17.78,-0.127; 9 20.32,0.127; 10 22.86,-0.127
1210 = smd 1.2 x 2: 1 -1.6,0; 2 1.6,0
SOT23-3 = smd 0.8 x 0.9: 1 -0.95,-1; 2 0.95,-1; 3 0,1.1
SOT323 = smd 0.7 x 0.7: 1 -0.65,-0.925; 2 0.65,-0.925; 3 0,0.925
R0603 = smd 1 x 1.1: 1 -0.85,0; 2 0.85,0
R0603-DASHES = smd 1 x 1.1: 1 -0.85,0; 2 0.85,0
SKHMPXE010 = smd 1.6 x 1.4: 1 -4.2,2.25; 2 4.2,2.25; 3 -4.2,-2.25; 4 4.2,-2.25; 5 4.2,0
PAD-JUMPER-2-NC_BY_TRACE_YES_SILK = smd 0.635 x 1.27: 1 -0.508,0; 2 0.508,0
MCMT5-F-V = smd 1.35 x 1: 1 -3.575,1.425; 2 -3.575,0; 3 -3.575,-1.425; 4 3.575,1.425; 5 3.575,0; 6 3.575,-1.425 | smd 2 x 1.8: TAB1 0,4.05; TAB2 0,-4.05 | hole 1.05: 0,-1.9 | hole 0.75: 0,1.9
MOLEX-47364-0001 = smd 2.3 x 0.45: 1 3.1,1.3; 2 3.1,0.65; 3 3.1,0; 4 3.1,-0.65; 5 3.1,-1.3 | smd 1.9 x 2.375: GND1 0,2.95; GND4 0,-2.95 | smd 2.1 x 1.475: GND2 2.3,2.5; GND3 2.3,-2.5
MICRO-SD-SOCKET-PP = smd 0.8 x 1.5: 1 -8.94,10.7; 2 -7.84,10.3; 3 -6.74,10.7; 4 -5.64,10.9; 5 -4.54,10.7; 6 -3.44,10.9; 7 -2.34,10.7; 8 -1.24,10.7 | smd 1.8 x 1.4: CD1 -2.05,0.4; CD2 -7.75,0.4 | smd 1.4 x 1.9: GND1 -13.6,14.55; GND3 -0.45,13.55

### Placement (x,y rotation side)
C1  47.5,73.03 90 top
C2  43.43,72.9 90 top
C3  45.72,72.9 90 top
C4  56.52,72.64 270 top
C5  58.29,72.64 270 top
C6  30.61,72.39 90 top
C7  8.64,71.63 180 top
C8  28.07,71.63 180 top
C9  16.64,71.12 180 top
C10  8.64,69.85 180 top
C11  28.07,69.85 180 top
C12  8.64,68.07 180 top
C13  12.06,66.29 90 top
C14  16.76,65.53 180 top
C15  60.58,63.63 0 top
C16  19.3,62.74 0 top
C17  8.64,61.98 180 top
C18  8.64,60.2 180 top
C19  47.24,56.26 90 top
C20  9.71,11.87 90 top
C21  12.25,11.87 90 top
C22  3.75,11.59 180 top
C23  3.75,9.68 180 top
C24  3.75,7.65 180 top
C25  29.21,7.62 90 top
D1  36.58,71.63 180 top
D2  15.75,68.45 90 top
D3  17.78,68.45 270 top
D4  38.73,68.33 90 top
D5  25.4,67.44 180 top
D6  38.73,66.8 90 top
D7  13.97,66.42 270 top
D8  8.39,48.88 0 top
F1  36.58,73.41 0 top
FD1  2.5,77.5 0 top
FD2  62.5,77.5 0 top
FD3  27.5,74 0 top
FD4  37.5,63 0 top
FD5  2.5,2.5 0 top
IC1  51.69,75.82 0 top
IC2  51.69,67.69 180 top
IC3  32.77,67.31 270 top
IC4  27.9,20.8 90 top
J1  4.06,64.52 270 top
JP1  2.1,46 0 top
JP2  35.2,40.9 270 top
JP3  35.1,15.5 180 top
L1  14.1,62.74 180 top
Q1  30.99,61.72 0 top
Q2  34.8,59.44 180 top
Q3  13.46,59.1 0 top
R1  38.73,69.98 180 top
R2  27.05,67.44 270 top
R3  28.83,67.44 90 top
R4  38.73,65.02 180 top
R5  34.8,62.23 0 top
R6  30.99,59.18 180 top
R7  16.16,58.62 90 top
R8  30.99,56.64 180 top
R9  34.8,56.64 180 top
R10  47.24,53.21 270 top
R11  8.38,50.85 180 top
R12  14.73,7.62 270 top
R13  17.27,7.62 270 top
R14  19.81,7.62 270 top
R15  22.35,7.62 270 top
R16  24.89,7.62 270 top
R17  27.43,7.62 270 top
S1  25.91,59.05 90 top
S100  20.83,34.54 270 bottom
S101  28.07,39.5 270 bottom
SJ1  4.57,50.04 90 top
SJ2  12.19,50.04 90 top
SJ3  14.73,50.04 90 top
SJ4  17.27,50.04 90 top
SJ5  19.81,50.04 90 top
SJ6  22.35,50.04 90 top
SJ7  24.89,50.04 90 top
SJ8  14.73,11.18 90 top
SJ9  17.27,11.18 90 top
SJ10  19.81,11.18 90 top
SJ11  22.35,11.18 90 top
SJ12  24.89,11.18 90 top
SJ13  27.43,11.18 90 top
SW100  6.39,39.85 315 bottom
USB1  32.5,78.49 270 top
X701  49.02,48.26 270 top

### Tracks (layer width: path | path; a pad name or v marks a point on that pad's centre or on a via)
+3V3  (via drill 0.4 pad 0.41, 0.4 pad 0.61, 0.6 pad 0.61)
  Top 0.305: J1.10 5.44,65.77 5.71,66.04 | 5.71,66.04 6.48,66.8 v6.48,67.06 6.27,67.27 J1.7 | v36.7,55.37 v36.7,51.56 | J1.9 5.49,66.27 5.71,66.04 | R11.2 7.53,51.73 9.27,53.47 25.02,53.47 v24.99,53.69
  Top 0.406: R9.2 v32.89,56.64 | v32.89,56.64 R8.1 v32.89,56.64 | X701.4 59.97,53.85 61.09,53.85 61.34,54.1 61.34,60.33 59.44,62.23 v58.42,62.23 | C19.1 R10.1 47.24,54.1 47.12,54.23 46.1,54.23 45.97,54.1 | IC4.2 9.18,20.68 4.7,16.2 4.7,15.45 JP3.13 | C25.1 29.18,6.8 27.5,6.8 27.47,6.77 R17.2 R16.2 R15.2 R14.2 R13.2 R12.2
  Top 0.61: C5.1 56.62,73.49 C4.1 53.43,73.59 IC1.3 53.09,73.74 53.09,72.9 51.69,71.5 IC2.2 IC2.4
  Top 0.813: v41.6,51.05 37.21,51.05 v36.7,51.56 | v41.6,51.05 41.8,51.05 | 41.8,51.05 v42.6,51.05 45.47,51.05 45.97,51.56 45.97,54.1 45.97,61.09 47.24,62.36 48.13,62.36 v48.26,62.23 | L1.1 v17.02,62.74 C16.1 | JP3.13 4.62,11.67 C22.1 C23.1 4.7,7.75 C24.1 11.15,7.65 12,6.8 v12.9,6.8 | v12.9,6.8 14.7,6.8 R12.2 12.93,6.77 v12.9,6.8 | v41.6,51.05 41.8,51.05
  Bottom 0.305: v6.48,67.06 9.14,67.06 10.67,65.53 10.67,63.5 11.43,62.74 v17.02,62.74 | v24.99,53.69 25.75,52.93
  Bottom 0.406: v32.89,56.64 35.43,56.64 v36.7,55.37
  Bottom 0.813: v36.7,51.56 36.45,51.82 30.8,51.82 27.5,51.82 | v17.02,62.74 17.02,57.02 18.03,56.01 22.67,56.01 v24.99,53.69 25.75,52.93 26.83,51.85 | 26.83,51.85 27.5,51.82 | 27.5,51.82 26.86,51.82 26.83,51.85 | v12.9,6.8 12.9,7.1 14.2,8.4 28.4,8.4 29.8,9.8 29.8,12.5 30.6,13.3 36.2,13.3 37.5,14.6 37.5,39.1 39.7,41.3 39.7,49.15 v41.6,51.05 | v42.6,51.05 41.65,51.05 41.6,51
  other vias: 48.26,67.31 50.8,67.31 53.34,67.31 55.88,67.31 58.42,67.31 57.15,64.77 55.88,62.23 54.61,64.77 53.34,62.23 49.53,64.77 50.8,62.23
  pour Top (rank 2, no thermals): 46.99,69.09 50.29,69.09 50.8,69.6 50.8,71.37 51.05,71.63 52.32,71.63 52.58,71.37 52.58,69.6 53.09,69.09 59.44,69.09 59.94,68.58 59.94,62.36 59.44,61.85 46.99,61.85 46.61,62.23 46.61,68.71
  pour Bottom (rank 2, no thermals): 46.61,68.71 46.99,69.09 59.44,69.09 59.94,68.58 59.94,62.36 59.44,61.85 46.99,61.85 46.61,62.23
+5V  (via drill 0.4, 0.4 pad 0.61)
  Top 0.305: C8.1 28.92,71.53 C11.1 29.04,69.72 29.46,69.72 | 29.46,69.72 v30.23,69.72 | v30.23,69.72 30.35,69.72 | 30.35,69.72 30.27,69.64 IC3.8 | 31.18,69.72 IC3.7 31.18,69.72 | 31.18,69.72 30.35,69.72 | 31.18,69.72 v30.23,69.72 | v30.23,69.72 29.46,69.72
  Top 0.61: C1.1 47.27,71.95 C3.1 C2.1 43.37,71.88 41.78,71.88 40.26,73.41 v39.12,73.41 | v39.12,73.41 F1.2 37.98,71.88 D1.C 37.97,71.63 F1.2 v39.12,73.41 | C1.1 47.66,72.01 49.4,72.01 49.38,71.02 IC2.3 | C1.1 49.82,72.17 50.16,72.52 51.18,72.52 51.69,73.03 IC1.2 IC1.2@
  Bottom 0.305: v39.12,73.41 38.23,72.52 35.42,72.52 32.63,69.72 v30.23,69.72
  other vias: 57.91,77.98 57.91,75.95 56.64,76.96 45.72,77.98 48.26,77.98 46.99,76.96 45.72,75.95 48.26,75.95 49.78,75.69 49.53,76.96 49.78,77.98 53.59,77.98 54.1,76.96 53.59,75.69 55.63,75.95 55.63,77.98
  pour Bottom: 44.96,78.23 45.47,78.74 57.91,78.74 58.42,78.23 58.42,73.91 57.91,73.41 50.29,73.41 49.28,74.42 46.48,74.42 44.96,75.95
  pour Top (no thermals): 51.31,74.93 50.8,75.44 45.47,75.44 44.96,75.95 44.96,78.23 45.47,78.74 57.91,78.74 58.42,78.23 58.42,75.95 57.91,75.44 52.58,75.44 52.07,74.93
BT_B  (via drill 0.4 pad 0.81)
  Top 0.406: R17.1 v27.43,9.65 | v27.43,9.65 SJ13.1 v27.43,9.65
  Bottom 0.254: 28.75,17.65 28.75,10.97 v27.43,9.65
  Bottom 0.406: S101.3 S101.4 30.32,19.22 28.75,17.65
BT_DOWN  (via drill 0.4 pad 0.81)
  Top 0.254: v17.27,9.65 SJ9.1
  Top 0.406: R13.1 v17.27,9.65
  Bottom 0.254: v17.27,9.65 17.27,13.08 16.05,14.3 16.05,19.64 14.1,21.59 12.06,23.62 12.06,33.34 12,33.4
  Bottom 0.305: SW100.6 5.99,35.2 10.2,35.2 12,33.4
BT_LEFT  (via drill 0.4 pad 0.81)
  Top 0.254: v19.81,9.65 SJ10.1
  Top 0.305: SJ10.1 v19.81,9.65 R14.1
  Bottom 0.254: SW100.3 11.68,39.81 11.68,37.08 11.68,34.42 12.57,33.53 12.57,23.88 18.59,17.86 18.59,10.87 v19.81,9.65
BT_MID  (via drill 0.4 pad 0.81)
  Top 0.254: v22.35,9.65 SJ11.1
  Top 0.406: v22.35,9.65 R15.1
  Bottom 0.254: SW100.2 9.68,43.13 10.46,43.13 12.19,41.4 12.19,36.96 12.19,34.54 13.08,33.66 13.08,24.13 19.18,18.03 19.94,18.03 21.13,16.74 21.18,10.82 v22.35,9.65
BT_RIGHT  (via drill 0.4 pad 0.81)
  Top 0.254: v14.73,9.78 SJ8.1
  Top 0.406: R12.1 v14.73,9.78
  Bottom 0.254: SW100.4 2.54,38.61 2.54,37.72 | 10.3,34.4 11.43,33.27 11.43,23.5 13.51,21.41 13.51,14.55 14.73,13.34 v14.73,9.78
  Bottom 0.305: SW100.4 2.2,37.67 2.2,37.2 4.9,34.5 9.2,34.5 10.2,34.5 10.3,34.4
BT_UP  (via drill 0.4 pad 0.81)
  Top 0.254: v24.89,9.65 SJ12.1
  Top 0.406: v24.89,9.65 R16.1
  Bottom 0.254: SW100.1 8.14,43.68 8.46,44 10.32,44.04 12.7,41.66 12.7,36.96 12.7,34.67 13.59,33.78 13.59,24.38 19.43,18.54 21.72,18.54 23.67,16.59 23.72,10.82 v24.89,9.65
ESP32_!RESET  (via drill 0.4 pad 0.41)
  Top 0.305: R8.2 30.14,55.54 30.1,55.5 | 30.1,55.5 34.42,55.5 35.05,54.86 35.05,51.56 35.05,51.55 v34.3,50.8 | 30.1,55.5 28.16,55.5
  Top 0.406: Q1.3 30.55,63.26 S1.4 28.16,55.5 S1.3 | JP3.12 7.1,15.69 7.1,16.9 10.45,20.25 IC4.3 10.45,23.55 10,24 9.5,24.5 9.5,36 11.1,37.6 27.8,37.6 33.8,43.6 35.3,43.6 36.7,45 36.7,46.7 34.6,48.8 v34.6,49
  Bottom 0.406: v34.3,50.8 34.3,49.3 v34.6,49
ESP32_FLASH/TOUCHE_MENU  (via drill 0.4 pad 0.41)
  Top 0.406: Q2.3 35.65,57.49 R9.1 35.65,50.89 v35.56,50.8 | IC4.25 29.43,40.18 | 29.43,40.18 JP1.14 | v24.5,38.7 27.95,38.7 29.43,40.18
  Bottom 0.406: 35.56,50.29 v35.56,50.8 35.56,46.31 JP1.14 | v24.5,38.7 24.46,38.74 S100.3 S100.4
ESP32_RX  (via drill 0.4 pad 0.41, 0.4 pad 0.81)
  Top 0.254: IC3.26 36.2,67.82 v36.58,68.2
  Top 0.305: IC3.26 36.19,67.81 36.2,67.82 v36.58,68.2 36.7,68.33 D4.C | v10.92,51.44 10.92,51.82 11.3,52.2 25.4,52.2 27.05,53.85 27.05,56.26 27.43,56.64 27.43,61.34 | 27.43,61.34 v27.05,61.72 27.43,61.34
  Top 0.406: JP1.5 12.3,46.09 12.3,42.9 12.99,42.21 IC4.34
  Bottom 0.305: v10.92,51.44 11.56,50.8 11.56,47.5 11.56,46.83 JP1.5 | v27.05,61.72 28.45,61.72 29.46,62.74 32,62.74 35.94,66.67 35.94,67.56 v36.58,68.2
ESP32_TX  (via drill 0.4 pad 0.41)
  Top 0.254: IC3.25 36.32,67.31
  Top 0.305: IC3.25 36.32,67.31 | 36.32,67.31 v36.7,67.06 | v36.7,67.06 36.96,66.8 D6.C | 36.32,67.31 36.45,67.31 v36.7,67.06 | v26.54,60.83 26.92,60.45 26.92,56.9 26.42,56.39 26.42,53.98 25.15,52.7 10.54,52.7 v10.03,52.2
  Top 0.406: JP1.4 9.8,45.79 9.8,43.5 11.72,41.58 IC4.35
  Bottom 0.305: v36.7,67.06 36.7,66.67 32.26,62.23 29.72,62.23 28.32,60.83 v26.54,60.83 | v10.03,52.2 10.03,51.31 10.75,50.59 10.75,48.05 10.75,46.9 JP1.4
GDR
  Top 0.305: J1.23 5.88,59.27 7,58.25 12.77,58.25 Q3.1
GND  (via drill 0.4 pad 0.41, 0.4 pad 0.61, 0.6 pad 0.41)
  Top 0.254: v2.79,62.23 2.83,62.27 J1.17 | J1.8 4.63,66.8 3.43,66.8 3.3,66.67 3.05,66.67
  Top 0.305: 33.27,71.25 IC3.3 33.27,69.72 | USB1.5 31.24,75.43 31.24,76.07 31.13,76.19 USB1.GND3
  Top 0.61: IC4.38 7.9,41.1 v5.5,43.7 | IC4.1 7.91,22.51 8.7,23.3 9.1,23.3
  Bottom 0.254: 8.77,37.58 SW100.TAB2
  Bottom 0.61: SW100.5 4.75,38.2 6.3,38.2 7.8,36.7 8.97,36.7 SW100.TAB2 | v5.5,43.7 5.9,42.5
  other vias: 30.86,48.51 58.42,51.69 50.8,56.01 4,76 12,76 20,76 28,76 24,72 12,72 5,72 20,72 40,76 48.76,73.46 53.97,72.44 60,76 60,72 40,72 44,68 44,64 44,60 44,56 40,56 40,60 24,76 16,76 8,76 20,68 24,68 20,60 24,60 5,56 52,60 48,60 56,60 60,60 52,56 56,48 60,48 16,36 20,36 20,32 20,28 8,8.7 12,8.7 12,4 8,4 4,4 16,4 20,4 24,4 28,4 4,54 6,54 40,54 44,54 52,54 50,54 32,54 34,54 32,50 22,66 22,58 26,58 12,70 14,70 2,68 2,66 2,64 2,62 2,60 42,68 42,64 38,60 38,61.6 62,68 62,72 62,76 63,59 63,56 63,53 63,51 33,50 33,54 29,65 30,65 26,65 25,61 13,69 15,61 11,61 14,56 16,56 12,60 20,58 19,59 24,58 2,54 2,51 10.4,25 26,23 24,28 24,25 10.4,28 10.4,32 10.8,36 6.8,47.6 33,58 31,58 35,59.5 35,70.5 36.5,71.75 32,68 33.5,68 33.5,66.5 32,66.5 32.75,67.25 33.75,72 31.75,73.25 29.25,73.25 56.51,70.16 58.29,70.41 42.03,73.71 43.3,75.24 15,60.1 15.7,60.6 20.3,61.3 21.5,62.7 23.6,64.7 22.3,63.3 20.5,64.2 11.5,64.2 10.8,67.6 13.3,66.3 17.9,68.4 15.9,68.4 10.8,72 10.7,69.9 11,61.9 9.5,72.8 17.5,72.3 18.7,71.2 7.2,19.9 9.5,23.2 10.7,38.5 16,38.6 20,38.6 28.9,31.9 31.9,31.9 29.4,29.4 31.9,29.4 31.9,34.9 31.9,37.4 32.9,39.4 32.4,26.9 32.4,24.4 33.4,21.9 40.9,46.4 40.9,42.4 40.4,37.9 40.4,31.9 40.4,26.9 40.4,21.9 40.4,17.4 40.4,12.9 31.4,14.4 20,25 1.5,7.7 1,9.7 1,11.7 14.5,32.5 17,32.5 15.5,30.7 14.5,29 17,29
  pour Top (rank 5): -0.25,80.52 65.53,80.52 65.53,-0.25 -0.25,-0.25
  pour Bottom (rank 5): -0.13,80.52 66.04,80.52 66.04,-0.76 -0.25,-0.76 -0.25,80.64
LCD_!RESET  (via drill 0.4)
  Top 0.305: v7.24,63.25 4.68,63.25 J1.15 | v14.73,51.44 SJ3.2
  Bottom 0.305: v7.24,63.25 7.24,57.28 11.81,52.7 13.59,52.7 v14.73,51.44
LCD_BUSY  (via drill 0.4)
  Top 0.305: J1.16 6.2,62.77 v6.48,62.48 | v12.19,51.44 SJ2.2
  Bottom 0.305: v6.48,62.48 6.48,57.15 v12.19,51.44
LCD_CS  (via drill 0.4)
  Top 0.305: J1.13 6.48,64.26 6.99,64.77 v8.51,64.77 | v19.81,51.44 SJ5.2
  Bottom 0.305: v8.51,64.77 8.51,64.64 8.76,64.39 8.76,57.66 12.45,53.98 17.27,53.98 v19.81,51.44
LCD_D/!S  (via drill 0.4)
  Top 0.305: J1.14 4.68,63.75 6.73,63.75 6.99,64.01 v7.87,64.01 | v17.27,51.44 SJ4.2
  Bottom 0.305: v7.87,64.01 7.87,63.88 8.13,63.63 8.13,57.28 12.06,53.34 15.37,53.34 v17.27,51.44
LCD_MOSI  (via drill 0.4)
  Top 0.305: J1.11 5.7,65.27 6.48,66.04 7.11,66.04 v7.24,66.17 | v24.89,51.44 SJ7.2
  Bottom 0.305: v7.24,66.17 7.49,66.42 8.89,66.42 10.03,65.28 10.03,58.29 13.08,55.24 21.08,55.24 v24.89,51.44
LCD_SCK  (via drill 0.4)
  Top 0.305: J1.12 6.09,64.77 6.73,65.41 7.87,65.41 v8.13,65.66 | v22.35,51.44 SJ6.2
  Bottom 0.305: v8.13,65.66 8.76,65.66 9.4,65.02 9.4,57.91 12.7,54.61 19.18,54.61 v22.35,51.44
LED1
  Top 0.406: SJ1.2 4.5,50.55 4.5,51.6 4.8,51.9 6,51.9 6.4,51.5 6.4,49.4 6.64,49.16 D8.C
N$1
  Top 0.406: IC4.6 14.2,21.42 14.2,18.8 14.78,18.22 JP3.9
N$3
  Top 0.406: IC4.17 27.15,27.65 31.8,23 34.95,23 JP2.8
N$4
  Top 0.406: IC4.18 27.08,28.92 30.4,25.6 35.27,25.6 JP2.7
N$5  (via drill 1.1 pad 2.18)  (3 unrouted)
  other vias: 37.73,10.42 37.73,7.88 37.73,5.34 37.73,2.8
N$6
  Top 0.406: IC4.19 26.91,30.19 29,28.1 34.97,28.1 JP2.6
N$7
  Top 0.406: IC4.20 27.34,31.46 28.2,30.6 35.19,30.6 JP2.5
N$8
  Top 0.254: IC3.9 28.85,68.31 R3.2
N$9
  Top 0.406: IC4.21 27.53,32.73 28,33.2 34.99,33.2 JP2.4
N$10
  Top 0.254: IC3.24 35.93,66.81 36.32,66.42 36.32,65.66 34.42,63.75 33.95,63.28 R5.1
  Top 0.406: R5.1 32.77,62.23 32,61.47 32,60.79 Q1.2
N$11  (via drill 0.4 pad 0.81)
  Top 0.254: Q2.2 34.53,60.44 34.8,60.71 34.8,63.25 35.18,63.63 v35.31,63.63 | IC3.28 35.92,68.81 v36.58,69.34
  Top 0.406: R6.1 33.27,59.18 33.85,59.76 Q2.2
  Bottom 0.254: v36.58,69.34 37.47,68.71 37.47,66.67 35.94,65.15 35.94,64.26 v35.31,63.63
N$12
  Top 0.406: IC4.22 27.4,34 29.3,35.9 35.25,35.9 JP2.3
N$13
  Top 0.406: Q2.1 35.75,62.13 R5.2
N$14
  Top 0.406: Q1.1 30.04,59.28 R6.2
N$15
  Top 0.406: JP1.2 9.1,41.4 9.1,40.26 IC4.37
N$16
  Top 0.406: IC4.36 10.45,41.55 7.2,44.8 7.2,46.11 JP1.3 5.6,47.7 4.8,47.7 4.6,47.9 4.6,49.5 SJ1.1
N$17
  Top 0.406: IC4.33 14.26,42.26 14.8,42.8 JP1.6 12.19,48.48 SJ2.1
N$18
  Top 0.406: IC4.32 15.5,40.21 15.5,41.9 17.34,43.74 JP1.7 14.73,48.73 SJ3.1
N$20
  Top 0.406: IC4.30 18.1,40.21 18.1,41.7 22.42,46.02 JP1.9 19.81,48.73 SJ5.1
N$21
  Top 0.406: IC4.29 19.34,41.64 22.1,44.4 23.49,44.4 JP1.10 22.35,48.48 SJ6.1
N$22
  Top 0.406: D2.C D3.A 17.78,66.42 17.78,65.7 arc-90 C14.1
N$23
  Top 0.406: C14.2 15.65,65.27 D7.A 13.97,64.26 12.5,62.79 L1.2 12.57,62.66 12.57,61.47 13.46,60.58 Q3.3
N$24
  Top 0.406: IC4.28 20.61,41.71 22.5,43.6 24.97,43.6 JP1.11 24.89,48.73 SJ7.1
N$25
  Top 0.406: D8.A 9.6,49.42 9.6,50 9.6,50.48 arc90 R11.1
N$26
  Top 0.254: D5.A 27.02,68.31 R2.1
N$27
  Top 0.254: D4.A 39.61,70.08 R1.1
N$28
  Top 0.254: D6.A 39.61,65.05 R4.1
N$29  (via drill 1.1 pad 2.18)  (3 unrouted)
  other vias: 40.27,10.42 40.27,7.88 40.27,5.34 40.27,2.8
N$30  (via drill 1.1 pad 2.18)  (17 unrouted)
  other vias: 42.81,45.98 42.81,43.44 42.81,40.9 42.81,38.36 42.81,35.82 42.81,33.28 42.81,30.74 42.81,28.2 42.81,25.66 42.81,23.12 42.81,20.58 42.81,18.04 42.81,15.5 42.81,12.96 42.81,10.42 42.81,7.88 42.81,5.34 42.81,2.8
N$31  (via drill 1.1 pad 2.18)  (17 unrouted)
  other vias: 45.35,45.98 45.35,43.44 45.35,40.9 45.35,38.36 45.35,35.82 45.35,33.28 45.35,30.74 45.35,28.2 45.35,25.66 45.35,23.12 45.35,20.58 45.35,18.04 45.35,15.5 45.35,12.96 45.35,10.42 45.35,7.88 45.35,5.34 45.35,2.8
N$32
  Top 0.406: USB1.1 33.78,75.37 33.78,74.04 34.67,73.15 F1.1
N$33  (via drill 1.1 pad 2.18)  (17 unrouted)
  other vias: 47.89,45.98 47.89,43.44 47.89,40.9 47.89,38.36 47.89,35.82 47.89,33.28 47.89,30.74 47.89,28.2 47.89,25.66 47.89,23.12 47.89,20.58 47.89,18.04 47.89,15.5 47.89,12.96 47.89,10.42 47.89,7.88 47.89,5.34 47.89,2.8
N$34  (via drill 1.1 pad 2.18)  (17 unrouted)
  other vias: 50.43,45.98 50.43,43.44 50.43,40.9 50.43,38.36 50.43,35.82 50.43,33.28 50.43,30.74 50.43,28.2 50.43,25.66 50.43,23.12 50.43,20.58 50.43,18.04 50.43,15.5 50.43,12.96 50.43,10.42 50.43,7.88 50.43,5.34 50.43,2.8
N$35  (via drill 1.1 pad 2.18)  (17 unrouted)
  other vias: 52.97,45.98 52.97,43.44 52.97,40.9 52.97,38.36 52.97,35.82 52.97,33.28 52.97,30.74 52.97,28.2 52.97,25.66 52.97,23.12 52.97,20.58 52.97,18.04 52.97,15.5 52.97,12.96 52.97,10.42 52.97,7.88 52.97,5.34 52.97,2.8
N$36  (via drill 1.1 pad 2.18)  (17 unrouted)
  other vias: 55.51,45.98 55.51,43.44 55.51,40.9 55.51,38.36 55.51,35.82 55.51,33.28 55.51,30.74 55.51,28.2 55.51,25.66 55.51,23.12 55.51,20.58 55.51,18.04 55.51,15.5 55.51,12.96 55.51,10.42 55.51,7.88 55.51,5.34 55.51,2.8
N$37  (via drill 1.1 pad 2.18)  (17 unrouted)
  other vias: 58.05,45.98 58.05,43.44 58.05,40.9 58.05,38.36 58.05,35.82 58.05,33.28 58.05,30.74 58.05,28.2 58.05,25.66 58.05,23.12 58.05,20.58 58.05,18.04 58.05,15.5 58.05,12.96 58.05,10.42 58.05,7.88 58.05,5.34 58.05,2.8
N$38  (via drill 1.1 pad 2.18)  (17 unrouted)
  other vias: 60.59,45.98 60.59,43.44 60.59,40.9 60.59,38.36 60.59,35.82 60.59,33.28 60.59,30.74 60.59,28.2 60.59,25.66 60.59,23.12 60.59,20.58 60.59,18.04 60.59,15.5 60.59,12.96 60.59,10.42 60.59,7.88 60.59,5.34 60.59,2.8
N$39  (via drill 1.1 pad 2.18)  (17 unrouted)
  other vias: 63.13,45.98 63.13,43.44 63.13,40.9 63.13,38.36 63.13,35.82 63.13,33.28 63.13,30.74 63.13,28.2 63.13,25.66 63.13,23.12 63.13,20.58 63.13,18.04 63.13,15.5 63.13,12.96 63.13,10.42 63.13,7.88 63.13,5.34 63.13,2.8
N$40  (via drill 1.1 pad 2.18)  (3 unrouted)
  other vias: 32.65,10.42 32.65,7.88 32.65,5.34 32.65,2.8
N$41  (via drill 1.1 pad 2.18)  (3 unrouted)
  other vias: 35.19,10.42 35.19,7.88 35.19,5.34 35.19,2.8
N$42
  Top 0.406: IC4.4 11.72,20.02 9.7,18 JP3.11 9.71,15.36 C20.2
N$43
  Top 0.406: IC4.5 12.99,18.99 12.2,18.2 12.2,15.67 | 12.2,15.67 JP3.10 | 12.2,15.67 12.25,15.62 C21.2
N$44
  Top 0.406: IC4.7 15.5,21.45 15.5,19.5 17.32,17.68 JP3.8 14.73,13.04 SJ8.2
N$45
  Top 0.406: IC4.8 16.8,19.7 19.6,16.9 19.86,16.64 JP3.7 17.27,12.79 SJ9.2
N$46
  Top 0.406: IC4.9 18.07,19.96 JP3.6 19.81,13.04 SJ10.2
N$47
  Top 0.406: IC4.10 19.34,19.86 21.6,17.6 21.8,17.4 22.91,17.4 JP3.5 22.35,12.79 SJ11.2
N$48
  Top 0.406: IC4.11 20.61,19.99 22.1,18.5 22.3,18.3 24.81,18.3 JP3.4 24.89,13.04 SJ12.2
N$49
  Top 0.406: IC4.12 21.88,20.32 23,19.2 26.19,19.2 JP3.3 27.43,12.79 SJ13.2
N$63
  Top 0.406: IC4.31 16.8,42.1 19.88,45.18 JP1.8 17.27,48.48 SJ4.1
PREVGH
  Top 0.254: J1.4 6.54,68.77 6.73,68.96 10.54,68.96 12.06,67.44 C13.2
  Top 0.406: D7.C 13.85,67.69 12.7,67.69 12.28,67.14 C13.2
PREVGL
  Top 0.254: J1.2 6.01,69.77 6.99,70.74 10.41,70.74 10.79,71.12 C9.2 15.75,71.08 D2.A
RESE
  Top 0.305: J1.22 6.4,59.77 7.11,59.05 13.72,59.05 14.05,58.72 14.05,58.16 Q3.2
  Top 0.406: R7.1 16.1,58 16.1,58.2 14.47,58.2 Q3.2
SD_CD
  Top 0.406: 47.37,50.8 46.61,50.04 35.31,50.04 34.2,50.04 JP1.12 26.97,42.8 22.9,42.8 21.88,41.78 IC4.27 | 47.37,50.8 48.93,50.8 X701.CD1 | R10.2 47.37,52.24 47.37,50.8
SD_CLK
  Top 0.406: X701.5 59.69,52.83 57.78,52.83 56.01,51.05 56.01,49.66 54.36,48.01 51.94,48.01 39.91,48.01 38.9,47 38.9,17.1 35.7,13.9 34.29,13.9 JP3.2 28.19,20 23.5,20 23.15,20.35 IC4.13
SD_CMD  (via drill 0.4)
  Top 0.406: X701.3 v57.92,55 v57.91,54.99 | IC4.23 27.57,35.27 30.7,38.4 35.03,38.4 JP2.2
  Bottom 0.406: v57.91,54.99 57.91,53.85 53.09,49.02 52.86,48.8 47.1,48.8 46.7,49.2 46.7,51.4 46.35,51.85 40.65,51.85 38.5,49.8 38.5,47.9 | 38.5,47.9 38.5,41.87 35.03,38.4 JP2.2 | 38.5,47.9 38.5,48.02
SD_DATA0  (via drill 0.4)
  Top 0.406: X701.7 61.01,50.6 v61.09,50.67 | IC4.24 27.74,36.54 32.1,40.9 JP2.1
  Bottom 0.406: v61.09,50.67 61.09,53.85 57.91,57.02 57.15,57.02 55.63,55.5 55.63,53.59 55.63,53.54 54.53,52.45 40.35,52.45 37.6,49.8 37.6,48.3 37.6,43.17 JP2.1
SD_DATA1  (via drill 0.4)
  Top 0.406: X701.8 60.93,49.5 v60.96,49.53 | IC4.26 23.15,41.45 23.6,41.9 28.35,41.9 JP1.13
  Bottom 0.406: v60.96,49.53 61.09,49.53 61.98,50.42 61.98,53.85 58.17,57.66 56.77,57.66 54.99,55.88 54.99,53.95 54.14,53.1 39.95,53.1 36.85,50 36.8,48.8 36.8,45.6 35.6,44.4 34.31,44.4 JP1.13
SD_DATA2
  Top 0.406: X701.1 57.2,57.2 55.12,55.12 55.12,50.04 53.85,48.77 39.1,48.77 38.1,47.77 38.1,47.6 38.1,18.37 JP3.1 28.99,21.48 IC4.14
SD_DATA3  (via drill 0.4)
  Top 0.406: v47.62,49.78 47.24,49.4 38.1,49.4 37.3,48.6 37.3,47.66 37.3,38.3 37.3,22.55 JP2.9 35.31,20.6 33.1,20.6 27.32,26.38 IC4.16 | v57.53,56.13 59.29,56.13 X701.2
  Bottom 0.406: v47.62,49.78 52.83,49.78 56.39,53.34 56.39,54.99 v57.53,56.13
USB_DN_CON  (via drill 0.4)
  Top 0.305: IC3.5 32.27,71.62 v31.88,72.01 | v33.27,73.28 33.15,73.53 USB1.2
  Bottom 0.305: v31.88,72.01 32,72.14 33.15,73.28 v33.27,73.28
USB_DP_CON
  Top 0.305: USB1.3 32.5,72.78 32.77,72.52 IC3.4
VCOM
  Top 0.254: J1.1 5.62,70.27 6.99,71.63 C7.2
VDD  (via drill 0.4, 0.4 pad 0.61)
  Top 0.305: R2.2 27.69,66.59 | 27.69,66.59 v27.94,66.59 | v27.94,66.59 R3.1 | R4.2 v36.83,65.02 | v36.58,70.61 R1.2 | C6.1 30.7,71.25 | 30.7,71.25 31.24,71.25 | 31.24,71.25 31.77,70.72 IC3.6 31.75,69.83 31.75,70.74 31.24,71.25 | v27.94,66.59 27.69,66.59 | 31.24,71.25 30.7,71.25 | 30.7,71.25 30.61,71.25 v30.61,70.61
  Bottom 0.305: v36.83,65.02 36.96,65.02 37.97,66.04 37.97,69.47 v36.58,70.61 35.81,69.85 35.81,68.2 35.43,67.82 35.43,66.93 35.09,66.59 31.75,63.25 29.46,63.25 27.94,64.77 v27.94,66.59 27.94,68.83 29.72,70.61 30.48,70.61 v30.61,70.61
VGH
  Top 0.254: J1.20 5.9,60.77 7.11,61.98 C17.2
VGL
  Top 0.254: J1.21 7.97,60.27 C18.2
VSH
  Top 0.254: J1.5 7.59,68.27 C12.2
VSL
  Top 0.254: J1.3 6.27,69.27 6.73,69.72 7.66,69.72 C10.2

### Text on the board
Top: SHA Rev0.0.1 Dev | MarkusBec
tNames: RESET | IO0 | GND | IO23 | IO22 | U0TX | U0RX | IO21 | IO20 | IO19 | IO18 | IO5 | IO17 | IO16 | IO4 | IO2 | IO15 | SD1 | SD0 | CLK | CND | SD3 | SD2 | IO13 | 3V3 | GND | GND | EN | SVP | SVN | IO34 | IO35 | IO32 | IO33 | IO25 | IO26 | IO27 | IO14 | IO12 | SHA2017 Badge Dev rev0.0.1
bNames: B | A | FLASH
tStop: MarkusBec